# EAGLE design shield_ESP (EAGLE 6.6.0)
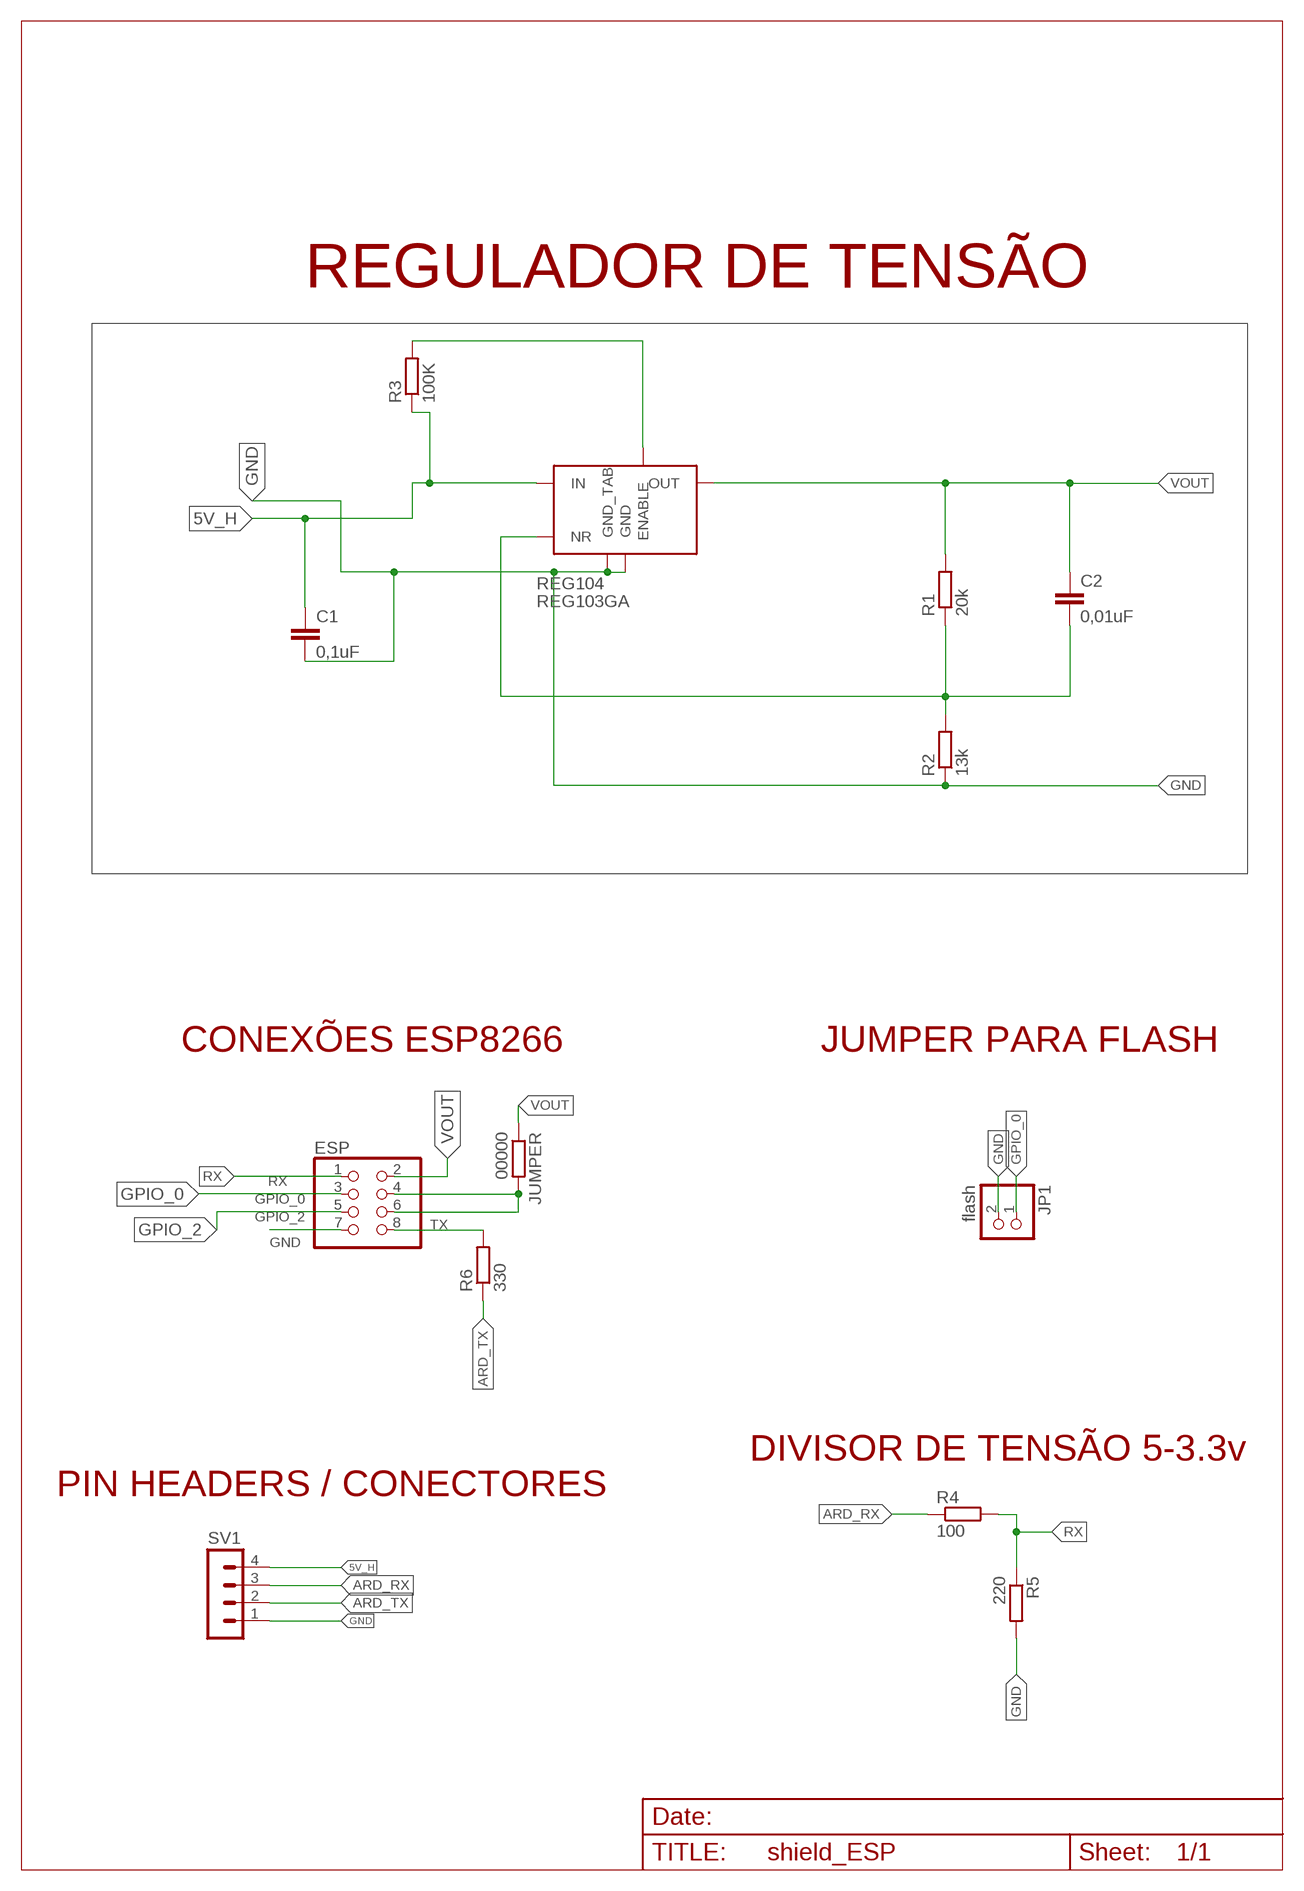
[diagram p0: schematic, sheet 1]

## Parts
C1  0,1uF  C-EU025-025X050  [C025-025X050]
C2  0,01uF  C-EU025-025X050  [C025-025X050]
ESP  PINHD-2X4  [2X04]
JP1  flash  PINHD-1X2/90  [1X02/90]
JUMPER  00000  R-EU_0207/7  [0207/7]
R1  20k  R-EU_0207/7  [0207/7]
R2  13k  R-EU_0207/7  [0207/7]
R3  100K  R-EU_0207/7  [0207/7]
R4  100  R-EU_0207/7  [0207/7]
R5  220  R-EU_0207/7  [0207/7]
R6  330  R-EU_0207/7  [0207/7]
REG104  REG103GA  [SOT223-5]
SV1  MA04-1  [MA04-1]

## Nets
5V_H: C1.1 R3.1 REG104.1(IN) SV1.4
ARD_RX: R4.1 SV1.3
ARD_TX: R6.1 SV1.2
GND: C1.2 ESP.7 JP1.2 R2.1 R5.2 REG104.3(GND) REG104.TAB(GND_TAB) SV1.1
GPIO_0: ESP.3 JP1.1
GPIO_2: ESP.5
N$1: ESP.4 ESP.6 JUMPER.2
N$3: C2.2 R1.1 R2.2 REG104.4(NR)
N$4: R3.2 REG104.5(ENABLE)
RX: ESP.1 R4.2 R5.1
TX: ESP.8 R6.2
VOUT: C2.1 ESP.2 JUMPER.1 R1.2 REG104.2(OUT)

## Notes on the sheet
- REGULADOR DE TENSÃO
- CONEXÕES ESP8266 | JUMPER PARA FLASH
- DIVISOR DE TENSÃO 5-3.3v
- PIN HEADERS / CONECTORES

## Library data of the parts
C1 C2 = rcl:C-EU: CAPACITOR, European symbol
ESP = pinhead:PINHD-2X4: PIN HEADER
JP1 = pinhead:PINHD-1X2: PIN HEADER
JUMPER R4-R6 = resistor:R-EU_: RESISTOR, European symbol
R1-R3 = rcl:R-EU_: RESISTOR, European symbol
REG104 = AlexW-Eagle-Libraries:REG103
SV1 = con-lstb:MA04-1: PIN HEADER; OC_FARNELL: unknown; OC_NEWARK: unknown

## Board
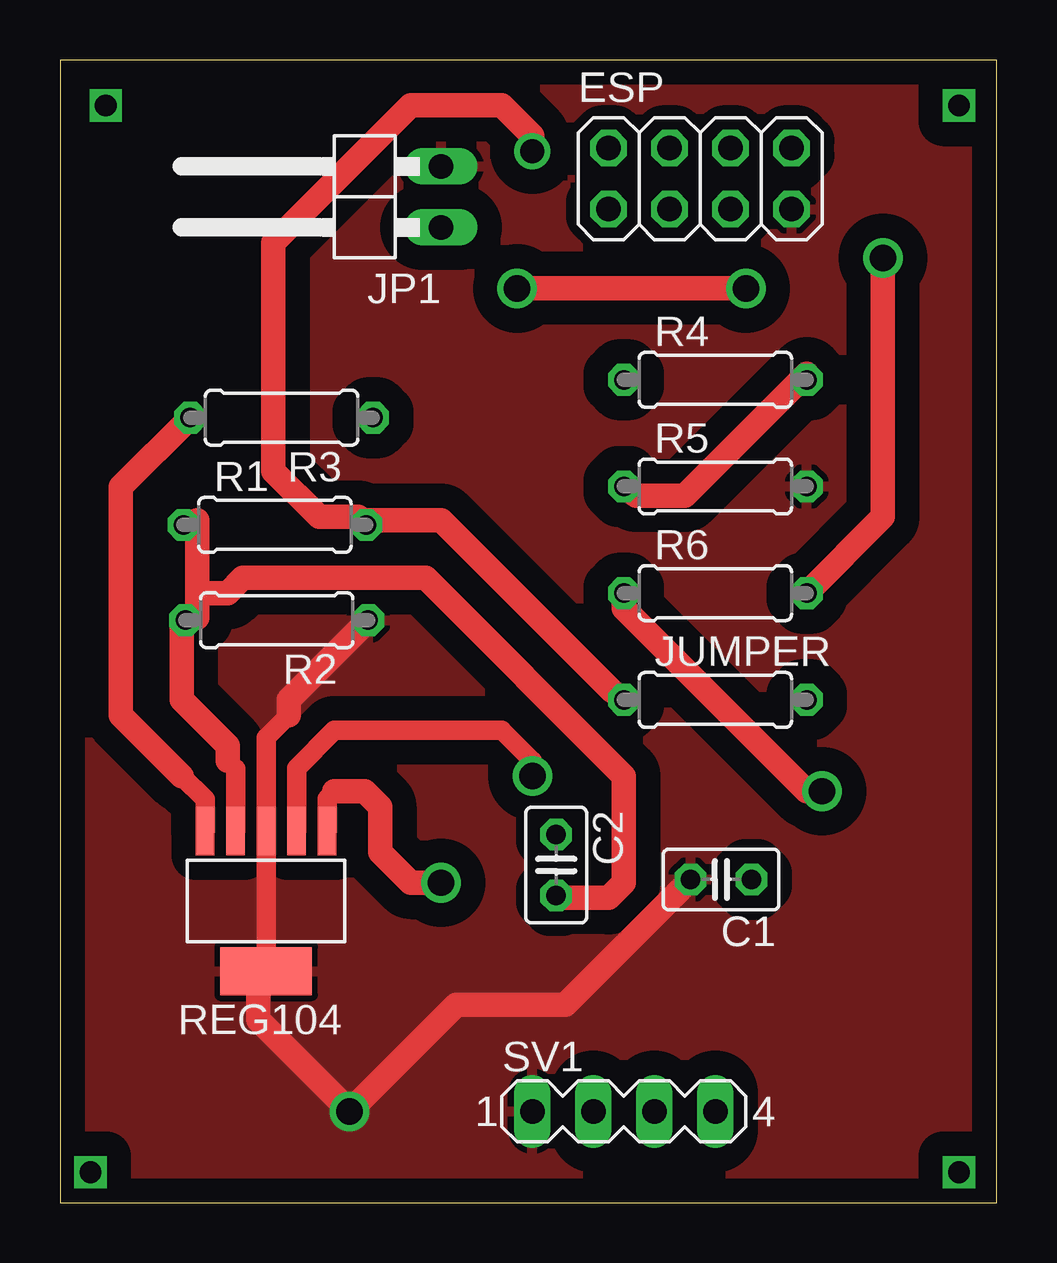
[diagram p1: board, top side]
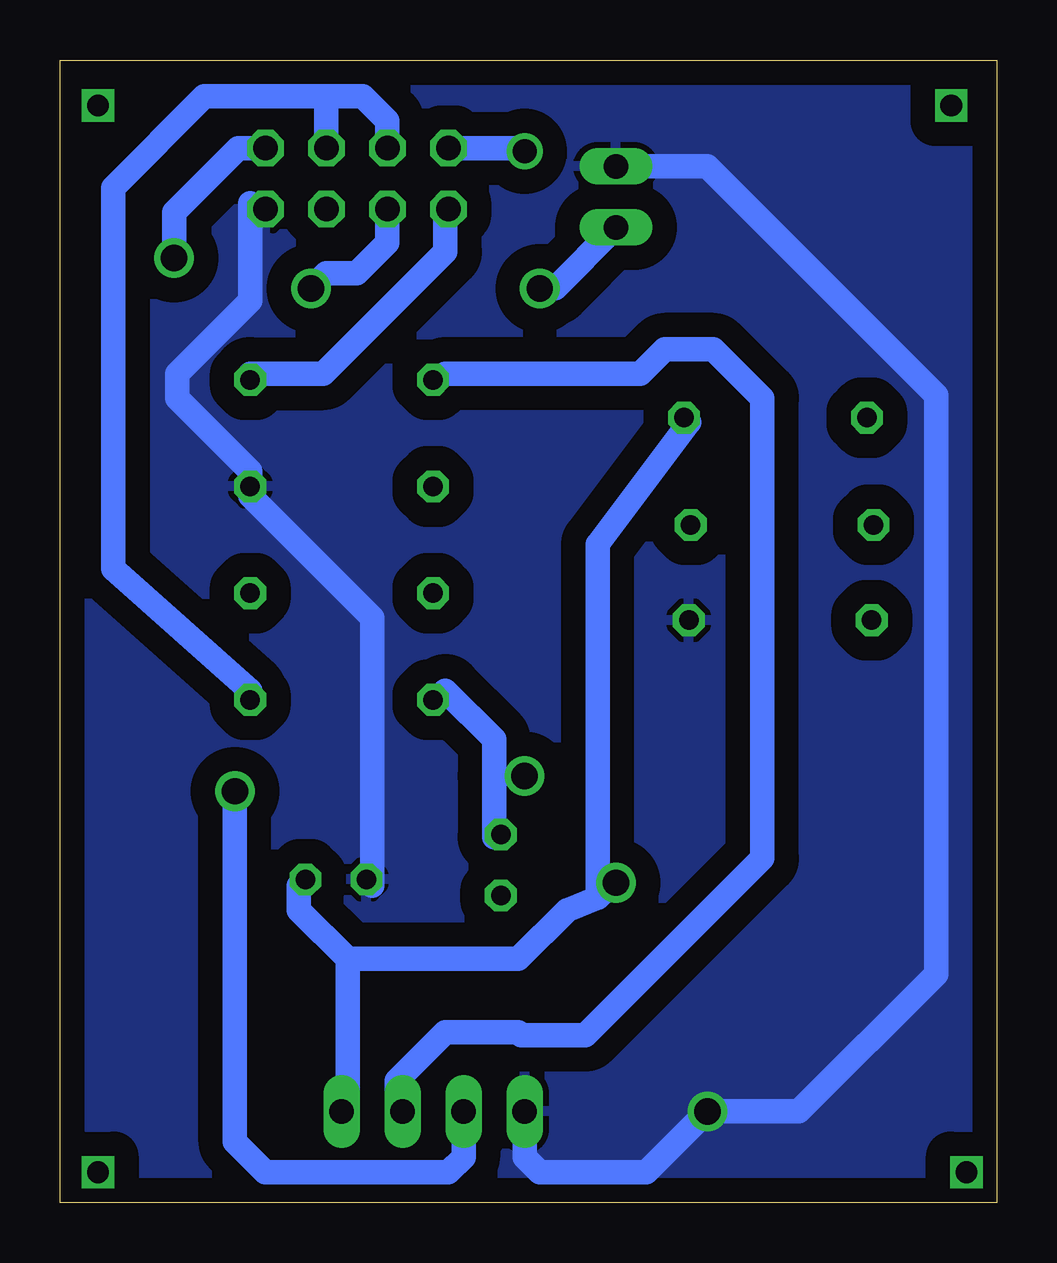
[diagram p2: board, bottom side, seen from below]

Size 39.04 x 47.62 mm. Coordinates in mm from the lower left corner, seen from the top.
Outline: 0,0 39.04,0 39.04,47.62 0,47.62 0,0
Copper layers (1*16): Top 0.035mm / dielectric 1.5mm / Bottom 0.035mm
Design rules "default *": minimum track width 40mil, minimum drill 24mil, track to track 40mil, track to pad 40mil, pad to pad 40mil, via to via 40mil, smd to smd 30mil, copper to edge 40mil, drill to drill 8mil, minimum pad ring 10mil, minimum via ring 8mil, stop-mask expansion 4mil, vias tented up to drill 0mil, thermal gap 10mil

### Footprints (pad centres in the part's own frame; a part is rotated, then mirrored left to right if it is on the bottom)
C025-025X050 = drill 0.813 octagon: 1 -1.27,0; 2 1.27,0
2X04 = drill 1.016 octagon: 1 -3.81,-1.27; 2 -3.81,1.27; 3 -1.27,-1.27; 4 -1.27,1.27; 5 1.27,-1.27; 6 1.27,1.27; 7 3.81,-1.27; 8 3.81,1.27
1X02/90 = drill 1.016 long: 1 -1.27,-3.81; 2 1.27,-3.81
0207/7 = drill 0.813 octagon: 1 -3.81,0; 2 3.81,0
SOT223-5 = smd 0.762 x 2.032: 1 -2.54,-2.54; 2 -1.27,-2.54; 3 0,-2.54; 4 1.27,-2.54; 5 2.54,-2.54 | smd 3.81 x 2.007: TAB 0,3.302
MA04-1 = drill 1.016 long: 1 -3.81,0; 2 -1.27,0; 3 1.27,0; 4 3.81,0

### Placement (x,y rotation side)
C1  27.54,13.47 180 top
C2  20.67,14.07 270 top
ESP  26.67,42.67 0 top
JP1  12.06,41.91 90 top
JUMPER  27.31,20.95 0 top
R1  8.95,28.25 0 top
R2  9.03,24.27 180 top
R3  9.23,32.71 180 top
R4  27.31,34.29 0 top
R5  27.31,29.84 0 top
R6  27.31,25.4 0 top
REG104  8.59,12.95 180 top
SV1  23.5,3.81 0 top

### Tracks (layer width: path | path; a pad name or v marks a point on that pad's centre or on a via)
5V_H  (via drill 1.1)
  Top 0.813: REG104.1 11.12,16.84 11.43,17.14
  Top 1.016: 11.43,17.14 12.7,17.14 13.33,16.51 13.33,14.61 14.61,13.34 v15.88,13.34
  Bottom 1.016: 16.64,12.7 17.91,12.19 19.94,10.16 27.05,10.16 | 16.64,12.7 16.64,27.43 12.83,32.51 R3.1 | 27.05,10.16 29.08,12.19 29.08,13.21 C1.1 | 27.05,10.16 27.05,4.06 SV1.4 | v15.88,13.34 16,13.34 16.64,12.7
ARD_RX
  Bottom 1.016: R4.1 22.99,34.54 14.86,34.54 13.84,35.56 11.81,35.56 9.78,33.53 9.78,14.35 17.15,6.99 19.81,6.99 19.94,7.11 22.99,7.11 25.02,5.08 25.02,4.06 SV1.3
ARD_TX  (via drill 1.1)
  Top 1.016: v31.75,17.14 31.12,17.14 23.5,24.77 R6.1
  Bottom 1.016: SV1.2 22.23,1.91 22.86,1.27 30.48,1.27 31.75,2.54 v31.75,17.14
GND  (via drill 1.1)
  Top 0.813: REG104.TAB REG104.3 8.59,19.38 9.53,20.32
  Top 1.016: 8.26,9.53 8.38,9.65 REG104.TAB 8.26,9.32 8.26,7.62 v12.06,3.81 16.51,8.26 21.06,8.26 C1.2 | 9.53,20.32 9.53,20.96 R2.1
  Bottom 1.016: C1.2 26.04,13.21 26.04,24.38 31.12,29.46 R5.2 31.12,30.48 34.16,33.53 34.16,34.54 31.12,37.59 31.12,41.66 ESP.7 | SV1.1 19.69,1.91 19.05,1.27 14.61,1.27 v12.06,3.81 8.26,3.81 2.54,9.53 2.54,33.66 12.06,43.18 JP1.2
  pour Top: 0,47.62 0,0 38.73,0 38.73,47.62
  pour Bottom: 0,47.62 0,0 38.73,0 38.73,47.62
GPIO_0  (via drill 1.1)
  Top 1.016: v28.58,38.1 v19.05,38.1
  Bottom 1.016: ESP.3 25.4,40.01 26.67,38.73 27.94,38.73 v28.58,38.1 | v19.05,38.1 18.42,38.1 JP1.1
N$1
  Bottom 1.016: JUMPER.2 31.12,21.34 36.83,26.42 36.83,42.29 33.02,46.1 27.94,46.1 | 27.94,46.1 26.42,46.1 25.4,45.09 ESP.4 | ESP.6 27.94,46.1
N$2  (via drill 0.9)
  other vias: 1.91,45.72
N$3
  Top 0.813: REG104.4 7.31,18.09 6.98,18.41
  Top 1.016: 5.71,25.4 5.71,28.45 R1.1 | 5.71,25.4 5.71,24.38 R2.2 5.08,24.13 5.08,20.95 6.98,19.05 6.98,18.41 | 5.71,25.4 6.98,25.4 7.62,26.04 15.24,26.04 23.5,17.78 23.5,13.34 22.86,12.7 20.77,12.7 C2.2
N$4
  Top 0.813: REG104.5 6.04,16.82 5.08,17.78
  Top 1.016: 5.08,17.78 2.54,20.32 2.54,29.83 R3.2
N$5  (via drill 0.9)
  other vias: 37.46,45.72
N$6  (via drill 0.9)
  other vias: 37.46,1.27
N$7  (via drill 0.9)
  other vias: 1.27,1.27
RX
  Top 1.016: R5.1 24,29.46 26.04,29.46 31.12,34.54 R4.2
  Bottom 1.016: ESP.1 22.99,41.66 22.99,39.62 28.07,34.54 31.12,34.54 R4.2
TX  (via drill 1.1)
  Top 1.016: v34.29,39.37 34.29,28.57 R6.2
  Bottom 1.016: ESP.8 31.62,43.94 34.29,41.27 v34.29,39.37
VOUT  (via drill 1, 1.1)
  Top 0.813: REG104.2 9.86,18.11 11.43,19.68 18.42,19.68 19.69,18.41 v19.69,17.78
  Top 1.016: JUMPER.1 22.99,21.34 15.88,28.45 12.83,28.45 R1.2 12.43,28.57 10.79,28.57 8.89,30.48 8.89,40.01 14.61,45.72 18.42,45.72 19.69,44.45 v19.69,43.81
  Bottom 0.813: v19.69,17.78 20.96,17.78
  Bottom 1.016: C2.1 20.96,15.24 20.96,17.78 20.96,19.3 22.99,21.34 JUMPER.1 | ESP.2 19.81,43.94 v19.69,43.81